# EAGLE design piano (EAGLE 9.3.0)
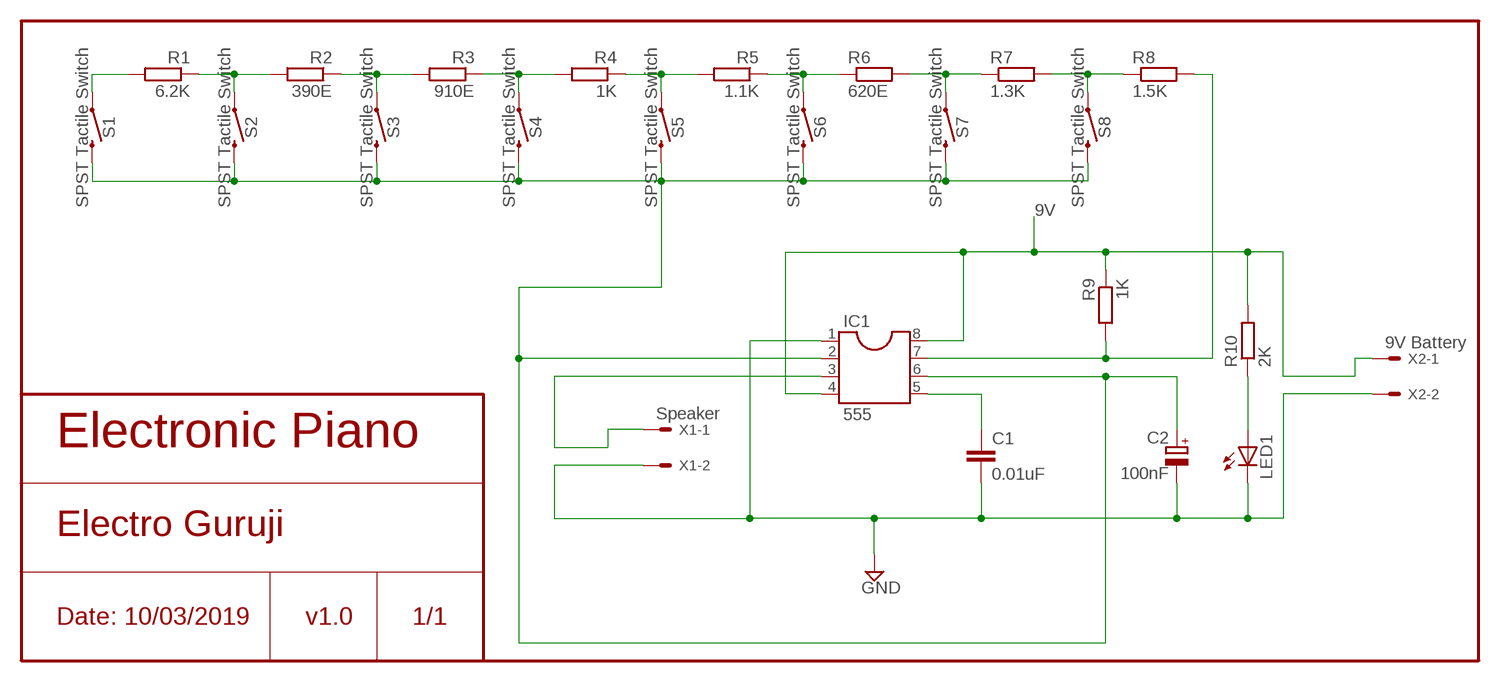
[diagram p0: schematic, sheet 1]

## Parts
C1  0.01uF  C-EU025-024X044  [C025-024X044]
C2  100nF  CPOL-EUE5-5  [E5-5]
IC1  555  DIL8S  [SOCKET-08]
LED1  LED5MM  [LED5MM]
R1  6.2K  R-EU_0204/5  [0204/5]
R2  390E  R-EU_0204/5  [0204/5]
R3  910E  R-EU_0204/5  [0204/5]
R4  1K  R-EU_0204/5  [0204/5]
R5  1.1K  R-EU_0204/5  [0204/5]
R6  620E  R-EU_0204/5  [0204/5]
R7  1.3K  R-EU_0204/5  [0204/5]
R8  1.5K  R-EU_0204/5  [0204/5]
R9  1K  R-EU_0204/5  [0204/5]
R10  2K  R-EU_0204/5  [0204/5]
S1  SPST Tactile Switch  MOMENTARY-SWITCH-SPST-PTH-6.0MM  [TACTILE_SWITCH_PTH_6.0MM]
S2  SPST Tactile Switch  MOMENTARY-SWITCH-SPST-PTH-6.0MM  [TACTILE_SWITCH_PTH_6.0MM]
S3  SPST Tactile Switch  MOMENTARY-SWITCH-SPST-PTH-6.0MM  [TACTILE_SWITCH_PTH_6.0MM]
S4  SPST Tactile Switch  MOMENTARY-SWITCH-SPST-PTH-6.0MM  [TACTILE_SWITCH_PTH_6.0MM]
S5  SPST Tactile Switch  MOMENTARY-SWITCH-SPST-PTH-6.0MM  [TACTILE_SWITCH_PTH_6.0MM]
S6  SPST Tactile Switch  MOMENTARY-SWITCH-SPST-PTH-6.0MM  [TACTILE_SWITCH_PTH_6.0MM]
S7  SPST Tactile Switch  MOMENTARY-SWITCH-SPST-PTH-6.0MM  [TACTILE_SWITCH_PTH_6.0MM]
S8  SPST Tactile Switch  MOMENTARY-SWITCH-SPST-PTH-6.0MM  [TACTILE_SWITCH_PTH_6.0MM]
X1  Speaker  KK-156-2  [KK-156-2]
X2  9V Battery  KK-156-2  [KK-156-2]

## Nets
9V: IC1.4 IC1.8 R9.1 R10.2 X2.1
GND: C1.2 C2.- IC1.1 LED1.K(C) X1.2 X2.2
N$1: IC1.7 R8.2 R9.2
N$2: C1.1 IC1.5
N$3: C2.+ IC1.2 IC1.6 S1.3 S2.3 S3.3 S4.3 S5.3 S6.3 S7.3 S8.3
N$4: R1.2 S1.1
N$5: R1.1 R2.2 S2.1
N$6: R2.1 R3.2 S3.1
N$7: R3.1 R4.2 S4.1
N$8: R4.1 R5.2 S5.1
N$9: R5.1 R6.1 S6.1
N$10: R7.2 R8.1 S8.1
N$11: R6.2 R7.1 S7.1
N$13: IC1.3 X1.1
N$14: LED1.A R10.1

## Notes on the sheet
- Electronic Piano
- Electro Guruji
- Date: 10/03/2019 | v1.0 | 1/1

## Library data of the parts
C1 = resistor:C-EU: CAPACITOR, European symbol
C2 = resistor:CPOL-EU: POLARIZED CAPACITOR, European symbol
IC1 = ic-package:DIL8: Dual In Line / Socket
LED1 = adafruit:LED: LED OSRAM: - CHIPLED LG R971, LG N971, LY N971, LG Q971, LY Q971, LO R971, LY R971 LH N974, LH R974 LS Q976, LO Q976, LY Q976 LO Q996 - Hyper CHIPLED LW Q18S LB Q993, LB Q99A, LB R99A - SideLED LS A670, LO A670, LY A670, LG A670, LP A670 LB A673, LV A673, LT A673, LW A673 LH A674 LY A675 LS A676, LA A676, LO A676, LY A676, LW A676 LS A679, LY A679, LG A679 - Hyper Micro SIDELED® LS Y876, LA Y876, LO Y876, LY Y876 LT Y87S - SmartLED LW L88C, LW L88S LB L89C, LB L89S, LG L890 LS L89K, LO L89K, LY L89K LS L896, LA L896, LO L896, LY L896 - TOPLED LS T670, LO T670, LY T670, LG T670, LP T670 LSG T670, LSP T670, LSY T670, LOP T670, LYG T670 LG T671, LOG T671, LSG T671 LB T673, LV T673, LT T673, LW T673 LH T674 LS T676, LA T676, LO T676, LY T676, LB T676, LH T676, LSB T676, LW T676 LB T67C, LV T67C, LT T67C, LS T67K, LO T67K, LY T67K, LW E67C LS E67B, LA E67B, LO E67B, LY E67B, LB E67C, LV E67C, LT E67C LW T67C LS T679, LY T679, LG T679 LS T770, LO T770, LY T770, LG T770, LP T770 LB T773, LV T773, LT T773, LW T773 LH T774 LS E675, LA E675, LY E675, LS T675 LS T776, LA T776, LO T776, LY T776, LB T776 LHGB T686 LT T68C, LB T68C - Hyper Mini TOPLED® LB M676 - Mini TOPLED Santana® LG M470 LS M47K, LO M47K, LY M47K Source: http://www.osram.convergy.de/
R1-R10 = resistor:R-EU_: RESISTOR, European symbol
S1-S8 = SparkFun-Switches:MOMENTARY-SWITCH-SPST: Momentary Switch (Pushbutton) - SPST Normally-open (NO) SPST momentary switches (buttons, pushbuttons). Variants PTH-12MM - 12mm square, through-hole Momentary Pushbutton Switch - 12mm Square <https://www.sparkfun.com/products/9190> (COM-09190) PTH-6.0MM, PTH-6.0MM-KIT - 6.0mm square, through-hole Mini Pushbutton Switch <https://www.sparkfun.com/products/97> (COM-00097) KIT package intended for soldering kit's - only one side of pads' copper is exposed. PTH-RIGHT-ANGLE-KIT - Right-angle, through-hole Right Angle Tactile Button <https://www.sparkfun.com/products/10791> - Used on SparkFun BigTime Watch Kit <https://www.sparkfun.com/products/11734> SMD-12MM - 12mm square, surface-mount Tactile Button - SMD (12mm) <https://www.sparkfun.com/products/12993> (COM-12993) Used on SparkFun PicoBoard <https://www.sparkfun.com/products/11888> SMD-4.5MM - 4.5mm Square Trackball Switch Used on SparkFun Blackberry Trackballer Breakout <https://www.sparkfun.com/products/13169> SMD-4.6MMX2.8MM - 4.60mm x 2.80mm, surface mount Used on SparkFun SAMD21 Mini Breakout <https://www.sparkfun.com/products/13664> SMD-5.2MM, SMD-5.2-REDUNDANT - 5.2mm square, surface-mount Mini Pushbutton Switch - SMD <https://www.sparkfun.com/products/8720> (COM-08720) Used on Arduino Pro Mini <https://www.sparkfun.com/products/11114> REDUNDANT package connects both switch circuits together SMD-6.0X3.5MM - 6.0 x 3.5mm, surface mount Momentary Reset Switch SMD <https://www.sparkfun.com/products/8229> (COM-08229) SMD-6.2MM-TALL - 6.2mm square, surface mount Tactile Button - SMD (6mm) <https://www.sparkfun.com/products/12992> Used on SparkFun Digital Sandbox <https://www.sparkfun.com/products/12651> SMD-RIGHT-ANGLE - Right-angle, surface mount Used on SparkFun Block for Intel® Edison - Arduino <https://www.sparkfun.com/products/13036>; PROD_ID: SWCH-08441; SF_SKU: COM-00097
X1 X2 = con-molex:KK-156-2: KK 156 HEADER Source: http://www.molex.com/pdm_docs/sd/026604100_sd.pdf; MF: MOLEX; OC_FARNELL: unknown; OC_NEWARK: unknown

## Board
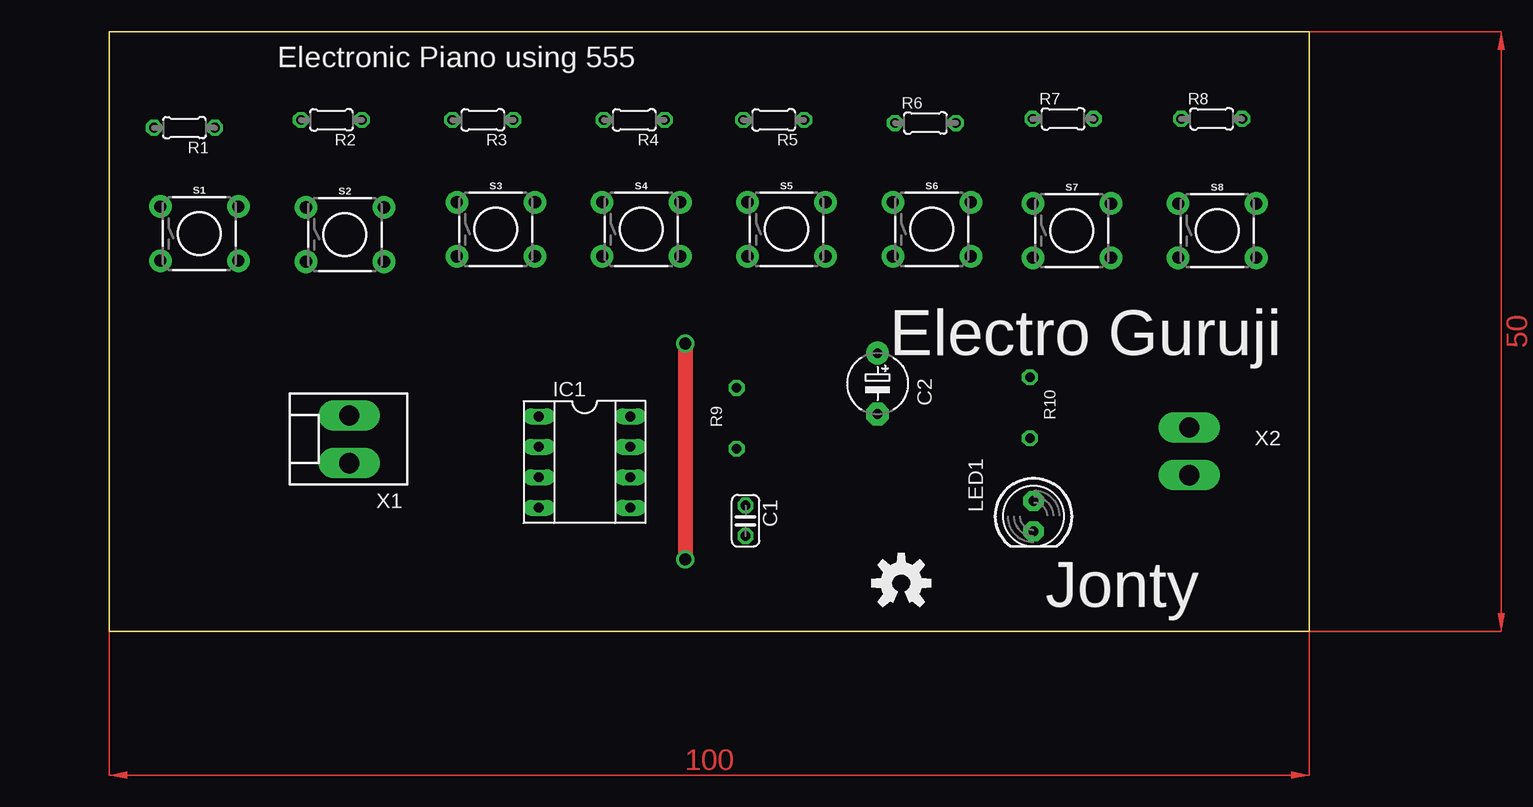
[diagram p1: board, top side]
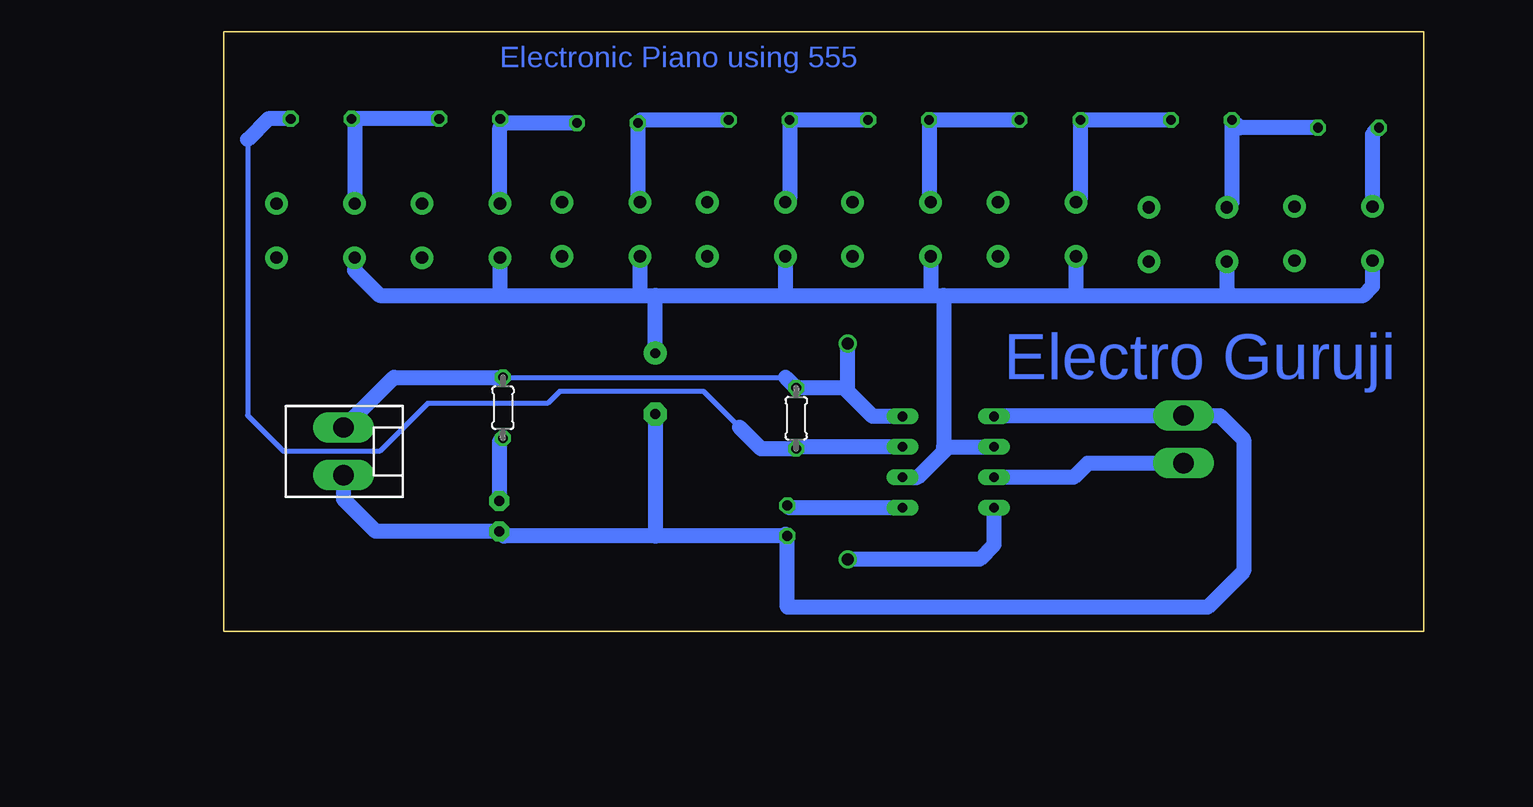
[diagram p2: board, bottom side, seen from below]

Size 100 x 50 mm. Coordinates in mm from the lower left corner, seen from the top.
Outline: 0,50 100,50 100,0 0,0 0,50
Copper layers (1*16): Top 0.035mm / dielectric 1.5mm / Bottom 0.035mm
Design rules "default": minimum track width 6mil, minimum drill 0.35mm, track to track 6mil, track to pad 6mil, pad to pad 6mil, via to via 6mil, smd to smd 6mil, copper to edge 40mil, drill to drill 6mil, minimum pad ring 10mil, minimum via ring 8mil, stop-mask expansion 4mil, vias tented up to drill 0mil, thermal gap 10mil

### Footprints (pad centres in the part's own frame; a part is rotated, then mirrored left to right if it is on the bottom)
C025-024X044 = drill 0.813 octagon: 1 -1.27,0; 2 1.27,0
E5-5 = drill 0.813 pad 1.905: + -2.54,0 | drill 0.813 pad 1.905 octagon: - 2.54,0
SOCKET-08 = drill 0.813 long: 1 -3.81,-3.81; 2 -1.27,-3.81; 3 1.27,-3.81; 4 3.81,-3.81; 5 3.81,3.81; 6 1.27,3.81; 7 -1.27,3.81; 8 -3.81,3.81
LED5MM = drill 0.813 pad 1.676 octagon: A -1.27,0; K 1.27,0
0204/5 = drill 0.813 octagon: 1 -2.54,0; 2 2.54,0
TACTILE_SWITCH_PTH_6.0MM = drill 1.016 pad 1.88: 1 -3.251,2.261; 2 3.251,2.261; 3 -3.251,-2.261; 4 3.251,-2.261
KK-156-2 = drill 1.7 pad 2.184 long: 1 -1.98,0; 2 1.98,0

### Placement (x,y rotation side)
C1  53.02,9.21 270 top
C2  64.02,20.64 270 top
IC1  39.61,14.1 270 top
LED1  77.02,9.59 270 top
R1  6.26,41.98 180 top
R2  18.51,42.63 180 top
R3  31.13,42.63 180 top
R4  43.75,42.63 180 top
R5  55.37,42.63 180 top
R6  68.01,42.37 0 top
R7  79.49,42.72 0 top
R8  91.87,42.72 0 top
R9  52.28,17.75 270 bottom
R10  76.72,18.63 90 bottom
S1  7.51,33.15 0 top
S2  19.64,33.08 0 top
S3  32.22,33.51 0 top
S4  44.33,33.51 0 top
S5  56.44,33.51 0 top
S6  68.55,33.51 0 top
S7  80.22,33.4 0 top
S8  92.33,33.4 0 top
U$1  [OSHW-LOGO-M]  66,4 0 top
X1  20,16 90 top
X2  90,15 270 bottom

### Tracks (layer width: path | path; a pad name or v marks a point on that pad's centre or on a via)
9V  (via drill 1)
  Top 1.27: v48,24 v48,6
  Bottom 0.406: R10.2 53.16,21.17
  Bottom 1.27: IC1.8 45.91,17.91 48.29,20.29 | 48.29,20.29 R9.1 53.16,21.17 | X2.1 85.81,21.17 R10.2 | 48.29,20.29 48,20.29 v48,24 | IC1.4 35.8,7.2 37,6 v48,6
GND
  Bottom 1.27: IC1.1 35.73,17.98 X1.2 16.98,17.98 15,16 15,5 18,2 53.02,2 C1.2 | C1.2 53.18,8.1 | 76.8,8.1 LED1.K | LED1.K 87.32,8.32 90,11 X2.2 | C1.2 64,7.94 | 64,7.94 76.64,7.94 LED1.K | C2.- 64.02,7.96 64,7.94
N$1
  Bottom 0.406: 57,17 60,20 72,20 73,19 83,19 87,15 95,15 98,18 98,41
  Bottom 1.27: IC1.7 52.12,15.37 R9.2 55.21,15.21 57,17 | R8.2 96.28,42.72 98,41
N$2
  Bottom 1.27: IC1.5 52.83,10.29 C1.1
N$3
  Bottom 1.27: S1.3 4.26,28.74 5,28 16,28 | S8.3 89.08,30.08 87,28 77,28 | 77,28 65,28 | 65,28 64,28 | 64,28 53,28 | 41,28 40,28 | 53,28 41,28 | 40,28 29,28 | 29,28 16,28 | S2.3 16.39,28.39 16,28 | S3.3 28.97,28.03 29,28 | S4.3 41.08,28.08 41,28 | S5.3 53.19,28.19 53,28 | S6.3 65.3,28.3 65,28 | S7.3 76.97,28.03 77,28 | IC1.6 42.17,12.83 39.63,15.37 | 39.63,15.37 40,15.37 40,28 | 39.63,15.37 IC1.2 | C2.+ 64.02,27.98 64,28
N$4
  Bottom 1.27: R1.2 4.26,41.44 S1.1
N$5
  Bottom 1.27: R1.1 15.32,41.98 R2.2 15.97,35.76 S2.1
N$6
  Bottom 1.27: R2.1 R3.2 28.59,36.15 S3.1
N$7
  Bottom 1.27: R3.1 R4.2 41.21,35.9 S4.1
N$8
  Bottom 1.27: R4.1 R5.2 52.83,36.13 S5.1
N$9
  Bottom 1.27: R5.1 65.21,42.63 R6.1 65.47,35.94 S6.1
N$10
  Bottom 1.27: R7.2 R8.1 89.08,42.47 S8.1
N$11
  Bottom 1.27: R6.2 76.6,42.37 | 76.6,42.37 R7.1 | S7.1 76.97,42 76.6,42.37
N$13
  Bottom 1.27: X1.1 20.02,14 28,14 29.17,12.83 IC1.3
N$14
  Bottom 1.27: R10.1 77.02,15.79 LED1.A
(copper drawn outside any net)
  shapes: Top area x2

### Text on the board
Bottom: Electronic Piano using 555 | Electro Guruji
tPlace: Electronic Piano using 555 | Electro Guruji | Jonty